# Altium schematic sheet SBORKA_WL.SchDoc
size 420 x 297 mm; SheetNumber: 1; SheetTotal: 4
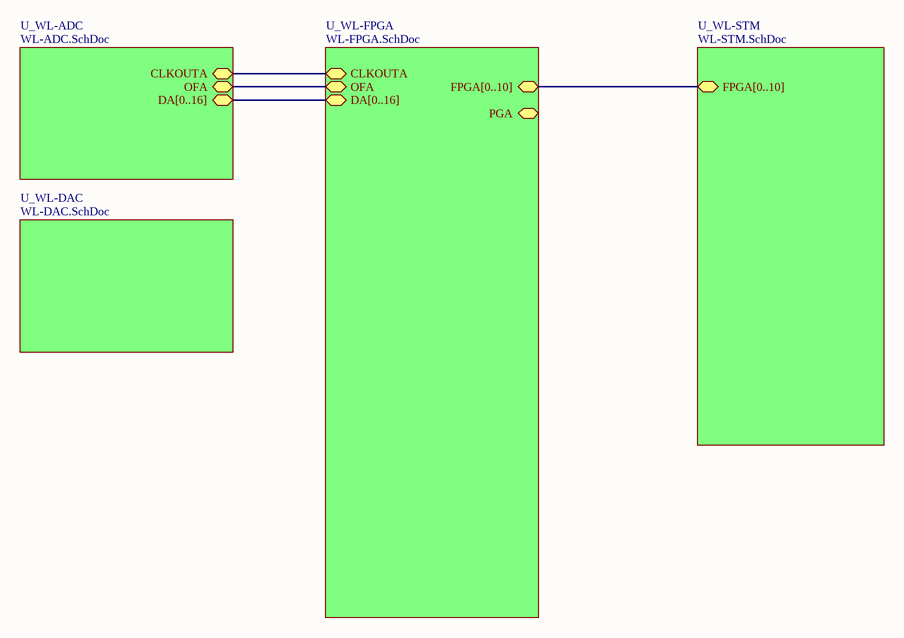
[diagram p0: SBORKA_WL.SchDoc]

## Sub-sheets
U_WL-ADC = WL-ADC.SchDoc: OFA (bidir), DA[0..16] (bidir), CLKOUTA (bidir)
U_WL-DAC = WL-DAC.SchDoc: no entries
U_WL-FPGA = WL-FPGA.SchDoc: OFA (bidir), CLKOUTA (bidir), PGA (bidir), DA[0..16] (bidir), FPGA[0..10] (bidir)
U_WL-STM = WL-STM.SchDoc: FPGA[0..10] (bidir)

## Nets
(unnamed): sheet U_WL-FPGA/OFA, sheet U_WL-ADC/OFA
(unnamed): sheet U_WL-FPGA/CLKOUTA, sheet U_WL-ADC/CLKOUTA

## Buses and harness runs
bus sheet U_WL-ADC/DA[0..16] = sheet U_WL-FPGA/DA[0..16]
bus sheet U_WL-FPGA/FPGA[0..10] = sheet U_WL-STM/FPGA[0..10]

## Notes on the sheet
- Подп. и дата
- Инв. № дубл.
- Взам. инв. №
- Инв. № подл.
- Изм.
- Лист
- № докум.
- Подп.
- Дата
- 2.106-A3
- Копировал
- Формат А3